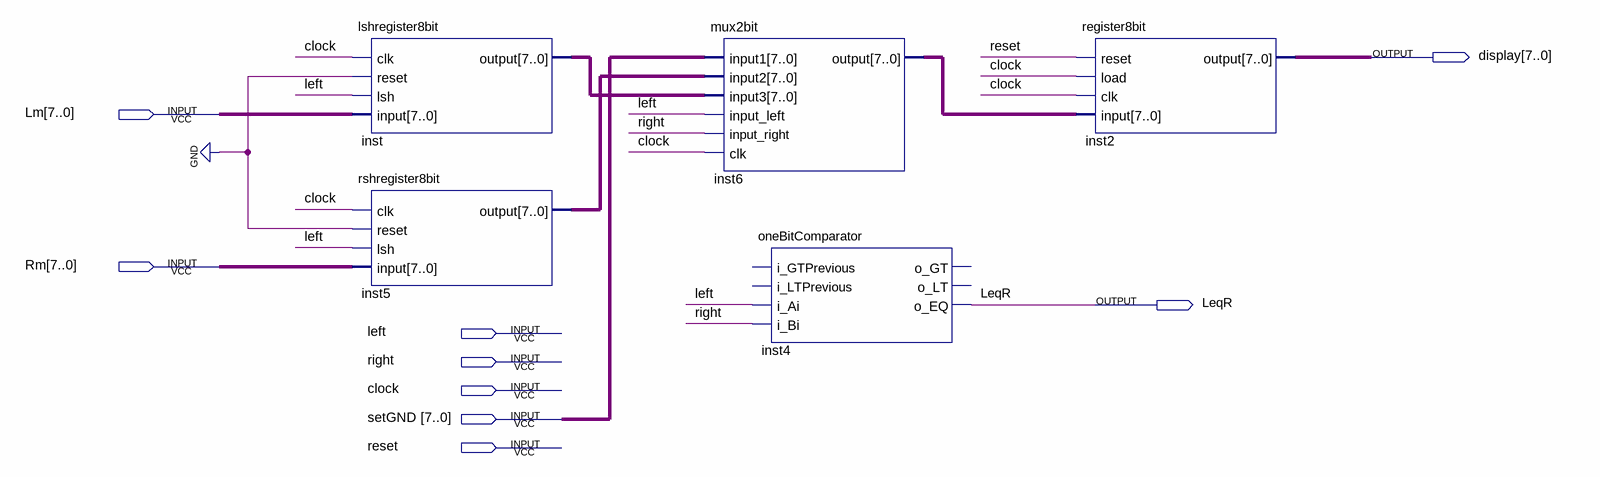
[diagram p0: schematic sheet]
// Quartus schematic lab1.bdf as structural Verilog: 5 symbols, 9 pins
module lab1 (
  input  [7:0] Lm,
  input  [7:0] Rm,
  input  left,
  input  right,
  input  clock,
  input  [7:0] setGND,
  input  reset,
  output [7:0] display,
  output LeqR
);

  wire [7:0] inst5_output, inst6_output, inst_output;

  lshregister8bit inst (.clk(clock), .reset(1'b0), .lsh(left), .\input (Lm), .\output (inst_output));
  rshregister8bit inst5 (.clk(clock), .reset(1'b0), .lsh(left), .\input (Rm), .\output (inst5_output));
  mux2bit inst6 (
    .input1(setGND), .input2(inst5_output), .input3(inst_output), .input_left(left), .input_right(right),
    .clk(clock), .\output (inst6_output));
  oneBitComparator inst4 (.i_Ai(left), .i_Bi(right), .o_EQ(LeqR));  // open: i_GTPrevious, i_LTPrevious, o_GT, o_LT
  register8bit inst2 (.reset(reset), .load(clock), .clk(clock), .\input (inst6_output), .\output (display));
endmodule
